# EAGLE design LED_MATRIX_CONNECTOR (EAGLE 7.2.0)
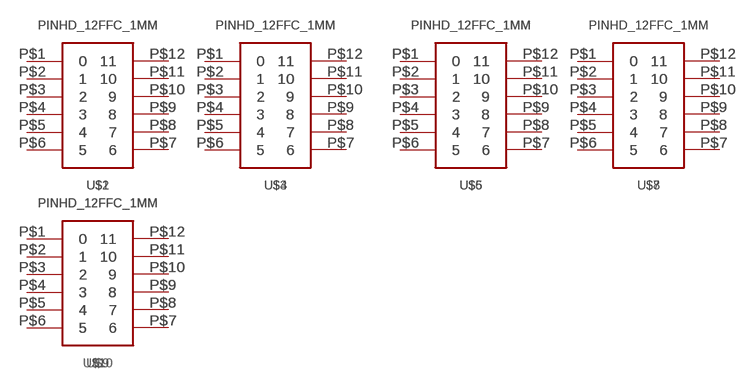
[diagram p0: schematic, sheet 1]

## Parts
U$1  PINHD_12FFC_1MM  [FFC_1MM]
U$2  PINHD_12FFC_1MM  [FFC_1MM]
U$3  PINHD_12FFC_1MM  [FFC_1MM]
U$4  PINHD_12FFC_1MM  [FFC_1MM]
U$5  PINHD_12FFC_1MM  [FFC_1MM]
U$6  PINHD_12FFC_1MM  [FFC_1MM]
U$7  PINHD_12FFC_1MM  [FFC_1MM]
U$8  PINHD_12FFC_1MM  [FFC_1MM]
U$9  PINHD_12FFC_1MM  [FFC_1MM]
U$10  PINHD_12FFC_1MM  [FFC_1MM]

## Nets
N$1: U$1.P$1 U$2.P$1
N$2: U$1.P$2 U$2.P$2
N$3: U$1.P$3 U$2.P$3
N$4: U$1.P$4 U$2.P$4
N$5: U$1.P$5 U$2.P$5
N$6: U$1.P$6 U$2.P$6
N$7: U$1.P$7 U$2.P$7
N$8: U$1.P$8 U$2.P$8
N$9: U$1.P$9 U$2.P$9
N$10: U$1.P$10 U$2.P$10
N$11: U$1.P$11 U$2.P$11
N$12: U$1.P$12 U$2.P$12
N$13: U$3.P$1 U$4.P$1
N$14: U$3.P$2 U$4.P$2
N$15: U$3.P$3 U$4.P$3
N$16: U$3.P$4 U$4.P$4
N$17: U$3.P$5 U$4.P$5
N$18: U$3.P$6 U$4.P$6
N$19: U$3.P$7 U$4.P$7
N$20: U$3.P$8 U$4.P$8
N$21: U$3.P$9 U$4.P$9
N$22: U$3.P$10 U$4.P$10
N$23: U$3.P$11 U$4.P$11
N$24: U$3.P$12 U$4.P$12
N$25: U$5.P$1 U$6.P$1
N$26: U$5.P$2 U$6.P$2
N$27: U$5.P$3 U$6.P$3
N$28: U$5.P$4 U$6.P$4
N$29: U$5.P$5 U$6.P$5
N$30: U$5.P$6 U$6.P$6
N$31: U$5.P$7 U$6.P$7
N$32: U$5.P$8 U$6.P$8
N$33: U$5.P$9 U$6.P$9
N$34: U$5.P$10 U$6.P$10
N$35: U$5.P$11 U$6.P$11
N$36: U$5.P$12 U$6.P$12
N$37: U$7.P$1 U$8.P$1
N$38: U$7.P$2 U$8.P$2
N$39: U$7.P$3 U$8.P$3
N$40: U$7.P$4 U$8.P$4
N$41: U$7.P$5 U$8.P$5
N$42: U$7.P$6 U$8.P$6
N$43: U$7.P$7 U$8.P$7
N$44: U$7.P$8 U$8.P$8
N$45: U$7.P$9 U$8.P$9
N$46: U$7.P$10 U$8.P$10
N$47: U$7.P$11 U$8.P$11
N$48: U$7.P$12 U$8.P$12
N$49: U$9.P$1 U$10.P$1
N$50: U$9.P$2 U$10.P$2
N$51: U$9.P$3 U$10.P$3
N$52: U$9.P$4 U$10.P$4
N$53: U$9.P$5 U$10.P$5
N$54: U$9.P$6 U$10.P$6
N$55: U$9.P$7 U$10.P$7
N$56: U$9.P$8 U$10.P$8
N$57: U$9.P$9 U$10.P$9
N$58: U$9.P$10 U$10.P$10
N$59: U$9.P$11 U$10.P$11
N$60: U$9.P$12 U$10.P$12

## Library data of the parts
U$1-U$10 = thar:PINHD_12

## Board
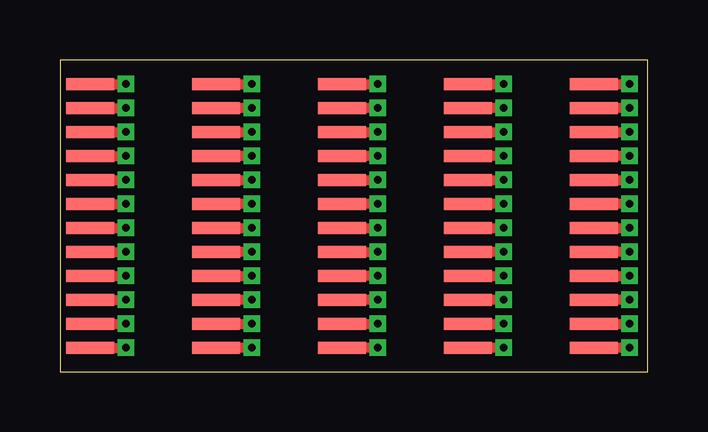
[diagram p1: board, top side]
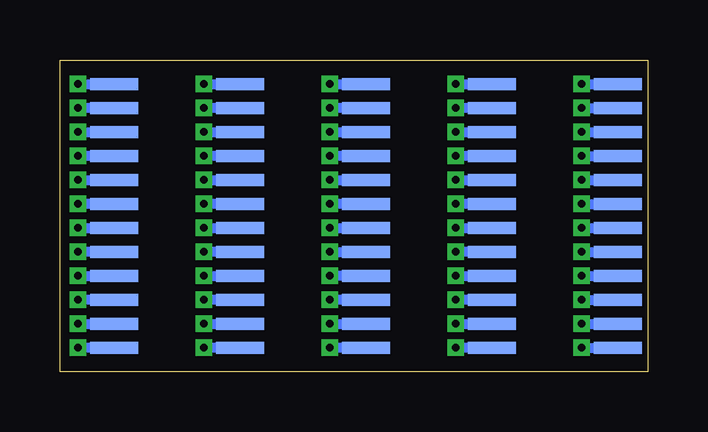
[diagram p2: board, bottom side, seen from below]

Size 24.5 x 13 mm. Coordinates in mm from the lower left corner, seen from the top.
Outline: 0,0 24.5,0 24.5,13 0,13 0,0
Copper layers (1*16): Top 0.035mm / dielectric 1.5mm / Bottom 0.035mm
Design rules "default": minimum track width 10mil, minimum drill 24mil, track to track 8mil, track to pad 8mil, pad to pad 8mil, via to via 8mil, smd to smd 8mil, copper to edge 40mil, drill to drill 8mil, minimum pad ring 10mil, minimum via ring 8mil, stop-mask expansion 4mil, vias tented up to drill 0mil, thermal gap 10mil

### Footprints (pad centres in the part's own frame; a part is rotated, then mirrored left to right if it is on the bottom)
FFC_1MM = smd 2 x 0.5: P$1 0,5.5; P$2 0,4.5; P$3 0,3.5; P$4 0,2.5; P$5 0,1.5; P$6 0,0.5; P$7 0,-0.5; P$8 0,-1.5; P$9 0,-2.5; P$10 0,-3.5; P$11 0,-4.5; P$12 0,-5.5

### Placement (x,y rotation side)
U$1  1.25,6.5 0 bottom
U$2  1.25,6.5 0 top
U$3  6.5,6.5 0 bottom
U$4  6.5,6.5 0 top
U$5  11.75,6.5 0 bottom
U$6  11.75,6.5 0 top
U$7  17,6.5 0 top
U$8  17,6.5 0 bottom
U$9  22.25,6.5 0 bottom
U$10  22.25,6.5 0 top

### Tracks (layer width: path | path; a pad name or v marks a point on that pad's centre or on a via)
N$1  (via drill 0.3)
  Top 0.406: U$2.P$1 v2.75,12
  Bottom 0.406: v2.75,12 U$2.P$1
N$2  (via drill 0.3)
  Top 0.406: U$2.P$2 v2.75,11
  Bottom 0.406: v2.75,11 U$2.P$2
N$3  (via drill 0.3)
  Top 0.406: U$2.P$3 v2.75,10
  Bottom 0.406: v2.75,10 U$2.P$3
N$4  (via drill 0.3)
  Top 0.406: U$2.P$4 v2.75,9
  Bottom 0.406: v2.75,9 U$2.P$4
N$5  (via drill 0.3)
  Top 0.406: U$2.P$5 v2.75,8
  Bottom 0.406: v2.75,8 U$2.P$5
N$6  (via drill 0.3)
  Top 0.406: U$2.P$6 v2.75,7
  Bottom 0.406: v2.75,7 U$2.P$6
N$7  (via drill 0.3)
  Top 0.406: U$2.P$7 v2.75,6
  Bottom 0.406: v2.75,6 U$2.P$7
N$8  (via drill 0.3)
  Top 0.406: U$2.P$8 v2.75,5
  Bottom 0.406: v2.75,5 U$2.P$8
N$9  (via drill 0.3)
  Top 0.406: U$2.P$9 v2.75,4
  Bottom 0.406: v2.75,4 U$2.P$9
N$10  (via drill 0.3)
  Top 0.406: U$2.P$10 v2.75,3
  Bottom 0.406: v2.75,3 U$2.P$10
N$11  (via drill 0.3)
  Top 0.406: U$2.P$11 v2.75,2
  Bottom 0.406: v2.75,2 U$2.P$11
N$12  (via drill 0.3)
  Top 0.406: U$2.P$12 v2.75,1
  Bottom 0.406: v2.75,1 U$2.P$12
N$13  (via drill 0.3)
  Top 0.406: U$4.P$1 v8,12
  Bottom 0.406: v8,12 U$4.P$1
N$14  (via drill 0.3)
  Top 0.406: v8,11 U$4.P$2
  Bottom 0.406: U$4.P$2 v8,11
N$15  (via drill 0.3)
  Top 0.406: U$4.P$3 v8,10
  Bottom 0.406: v8,10 U$4.P$3
N$16  (via drill 0.3)
  Top 0.406: v8,9 U$4.P$4
  Bottom 0.406: U$4.P$4 v8,9
N$17  (via drill 0.3)
  Top 0.406: U$4.P$5 v8,8
  Bottom 0.406: v8,8 U$4.P$5
N$18  (via drill 0.3)
  Top 0.406: v8,7 U$4.P$6
  Bottom 0.406: U$4.P$6 v8,7
N$19  (via drill 0.3)
  Top 0.406: U$4.P$7 v8,6
  Bottom 0.406: v8,6 U$4.P$7
N$20  (via drill 0.3)
  Top 0.406: v8,5 U$4.P$8
  Bottom 0.406: U$4.P$8 v8,5
N$21  (via drill 0.3)
  Top 0.406: U$4.P$9 v8,4
  Bottom 0.406: v8,4 U$4.P$9
N$22  (via drill 0.3)
  Top 0.406: v8,3 U$4.P$10
  Bottom 0.406: U$4.P$10 v8,3
N$23  (via drill 0.3)
  Top 0.406: U$4.P$11 v8,2
  Bottom 0.406: v8,2 U$4.P$11
N$24  (via drill 0.3)
  Top 0.406: v8,1 U$4.P$12
  Bottom 0.406: U$4.P$12 v8,1
N$25  (via drill 0.3)
  Top 0.406: U$6.P$1 v13.25,12
  Bottom 0.406: v13.25,12 U$6.P$1
N$26  (via drill 0.3)
  Top 0.406: v13.25,11 U$6.P$2
  Bottom 0.406: U$6.P$2 v13.25,11
N$27  (via drill 0.3)
  Top 0.406: U$6.P$3 v13.25,10
  Bottom 0.406: v13.25,10 U$6.P$3
N$28  (via drill 0.3)
  Top 0.406: v13.25,9 U$6.P$4
  Bottom 0.406: U$6.P$4 v13.25,9
N$29  (via drill 0.3)
  Top 0.406: U$6.P$5 v13.25,8
  Bottom 0.406: v13.25,8 U$6.P$5
N$30  (via drill 0.3)
  Top 0.406: v13.25,7 U$6.P$6
  Bottom 0.406: U$6.P$6 v13.25,7
N$31  (via drill 0.3)
  Top 0.406: U$6.P$7 v13.25,6
  Bottom 0.406: v13.25,6 U$6.P$7
N$32  (via drill 0.3)
  Top 0.406: U$6.P$8 v13.25,5
  Bottom 0.406: v13.25,5 U$6.P$8
N$33  (via drill 0.3)
  Top 0.406: v13.25,4 U$6.P$9
  Bottom 0.406: U$6.P$9 v13.25,4
N$34  (via drill 0.3)
  Top 0.406: v13.25,3 U$6.P$10
  Bottom 0.406: U$6.P$10 v13.25,3
N$35  (via drill 0.3)
  Top 0.406: U$6.P$11 v13.25,2
  Bottom 0.406: v13.25,2 U$6.P$11
N$36  (via drill 0.3)
  Top 0.406: v13.25,1 U$6.P$12
  Bottom 0.406: U$6.P$12 v13.25,1
N$37  (via drill 0.3)
  Top 0.406: U$8.P$1 v18.5,12
  Bottom 0.406: v18.5,12 U$8.P$1
N$38  (via drill 0.3)
  Top 0.406: v18.5,11 U$8.P$2
  Bottom 0.406: U$8.P$2 v18.5,11
N$39  (via drill 0.3)
  Top 0.406: U$8.P$3 v18.5,10
  Bottom 0.406: v18.5,10 U$8.P$3
N$40  (via drill 0.3)
  Top 0.406: v18.5,9 U$8.P$4
  Bottom 0.406: U$8.P$4 v18.5,9
N$41  (via drill 0.3)
  Top 0.406: U$8.P$5 v18.5,8
  Bottom 0.406: v18.5,8 U$8.P$5
N$42  (via drill 0.3)
  Top 0.406: v18.5,7 U$8.P$6
  Bottom 0.406: U$8.P$6 v18.5,7
N$43  (via drill 0.3)
  Top 0.406: U$8.P$7 v18.5,6
  Bottom 0.406: v18.5,6 U$8.P$7
N$44  (via drill 0.3)
  Top 0.406: v18.5,5 U$8.P$8
  Bottom 0.406: U$8.P$8 v18.5,5
N$45  (via drill 0.3)
  Top 0.406: U$8.P$9 v18.5,4
  Bottom 0.406: v18.5,4 U$8.P$9
N$46  (via drill 0.3)
  Top 0.406: v18.5,3 U$8.P$10
  Bottom 0.406: U$8.P$10 v18.5,3
N$47  (via drill 0.3)
  Top 0.406: U$8.P$11 v18.5,2
  Bottom 0.406: v18.5,2 U$8.P$11
N$48  (via drill 0.3)
  Top 0.406: v18.5,1 U$8.P$12
  Bottom 0.406: U$8.P$12 v18.5,1
N$49  (via drill 0.3)
  Top 0.406: U$10.P$1 v23.75,12
  Bottom 0.406: v23.75,12 U$10.P$1
N$50  (via drill 0.3)
  Top 0.406: v23.75,11 U$10.P$2
  Bottom 0.406: U$10.P$2 v23.75,11
N$51  (via drill 0.3)
  Top 0.406: U$10.P$3 v23.75,10
  Bottom 0.406: v23.75,10 U$10.P$3
N$52  (via drill 0.3)
  Top 0.406: v23.75,9 U$10.P$4
  Bottom 0.406: U$10.P$4 v23.75,9
N$53  (via drill 0.3)
  Top 0.406: U$10.P$5 v23.75,8
  Bottom 0.406: v23.75,8 U$10.P$5
N$54  (via drill 0.3)
  Top 0.406: v23.75,7 U$10.P$6
  Bottom 0.406: U$10.P$6 v23.75,7
N$55  (via drill 0.3)
  Top 0.406: U$10.P$7 v23.75,6
  Bottom 0.406: v23.75,6 U$10.P$7
N$56  (via drill 0.3)
  Top 0.406: v23.75,5 U$10.P$8
  Bottom 0.406: U$10.P$8 v23.75,5
N$57  (via drill 0.3)
  Top 0.406: U$10.P$9 v23.75,4
  Bottom 0.406: v23.75,4 U$10.P$9
N$58  (via drill 0.3)
  Top 0.406: v23.75,3 U$10.P$10
  Bottom 0.406: U$10.P$10 v23.75,3
N$59  (via drill 0.3)
  Top 0.406: U$10.P$11 v23.75,2
  Bottom 0.406: v23.75,2 U$10.P$11
N$60  (via drill 0.3)
  Top 0.406: v23.75,1 U$10.P$12
  Bottom 0.406: U$10.P$12 v23.75,1